# EAGLE schematic Kaya (EAGLE 8.5.0)

## Sheet 1 of 2: Power Supply
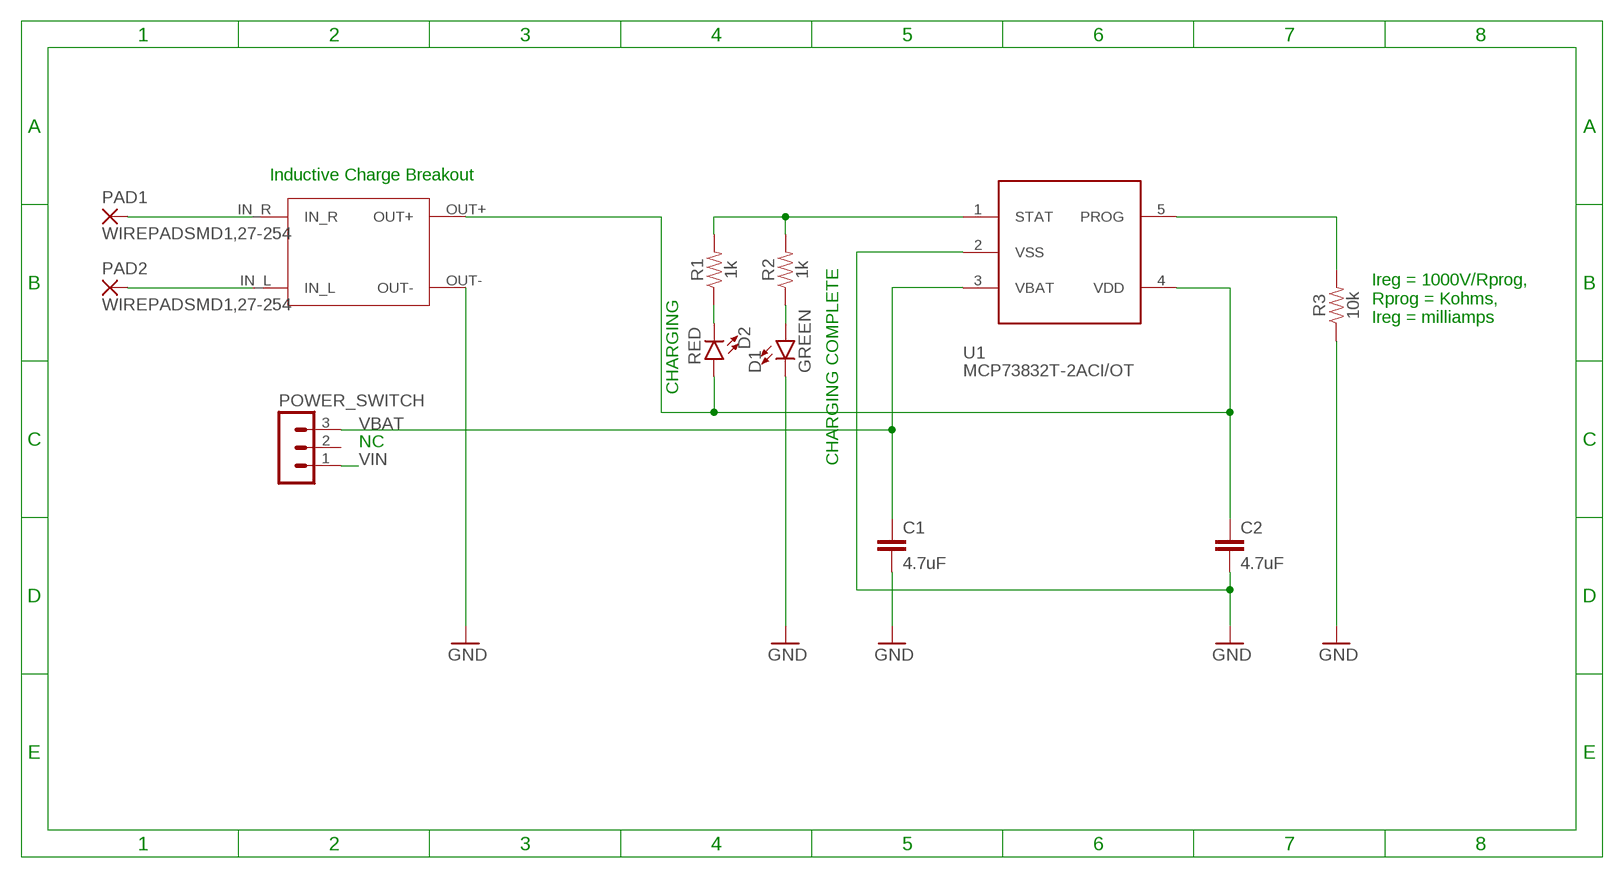
[diagram p0: schematic, sheet 1]

### Parts
C1  4.7uF  4.7UF0603  [0603]
C2  4.7uF  4.7UF0603  [0603]
D1  GREEN  LED-GREEN0603  [LED-0603]
D2  RED  LED-RED0603  [LED-0603]
PAD1  WIREPADSMD1,27-254  [SMD1,27-2,54]
PAD2  WIREPADSMD1,27-254  [SMD1,27-2,54]
POWER_SWITCH  MA03-1  [MA03-1]
R1  1k  1KOHM-0603-1/10W-1%  [0603]
R2  1k  1KOHM-0603-1/10W-1%  [0603]
R3  10k  10KOHM-0603-1/10W-1%  [0603]
U1  MCP73832T-2ACI/OT  [SOT23-5]
U$1  INDUCTIVE-CHARGE-5V  [INDUCTIVE-CHARGE-5V]

### Nets
GND: C1.2 C2.2 D1.C R3.1 U1.2(VSS) U$1.OUT- ; also sheet 2
N$1: R3.2 U1.5(PROG)
N$2: C2.1 D2.A U1.4(VDD) U$1.OUT+
N$7: D2.C R1.1
N$8: R1.2 R2.2 U1.1(STAT)
N$9: D1.A R2.1
N$10: PAD1.1(P) U$1.IN_R
N$11: PAD2.1(P) U$1.IN_L
VBAT: C1.1 POWER_SWITCH.3 U1.3(VBAT)
VIN: POWER_SWITCH.1 ; also sheet 2
Unconnected: POWER_SWITCH.2

### Notes on the sheet
- Inductive Charge Breakout
- Ireg = 1000V/Rprog,
  Rprog = Kohms,
  Ireg = milliamps
- CHARGING
- NC
- CHARGING COMPLETE

## Sheet 2 of 2: BLE NANO + IMU
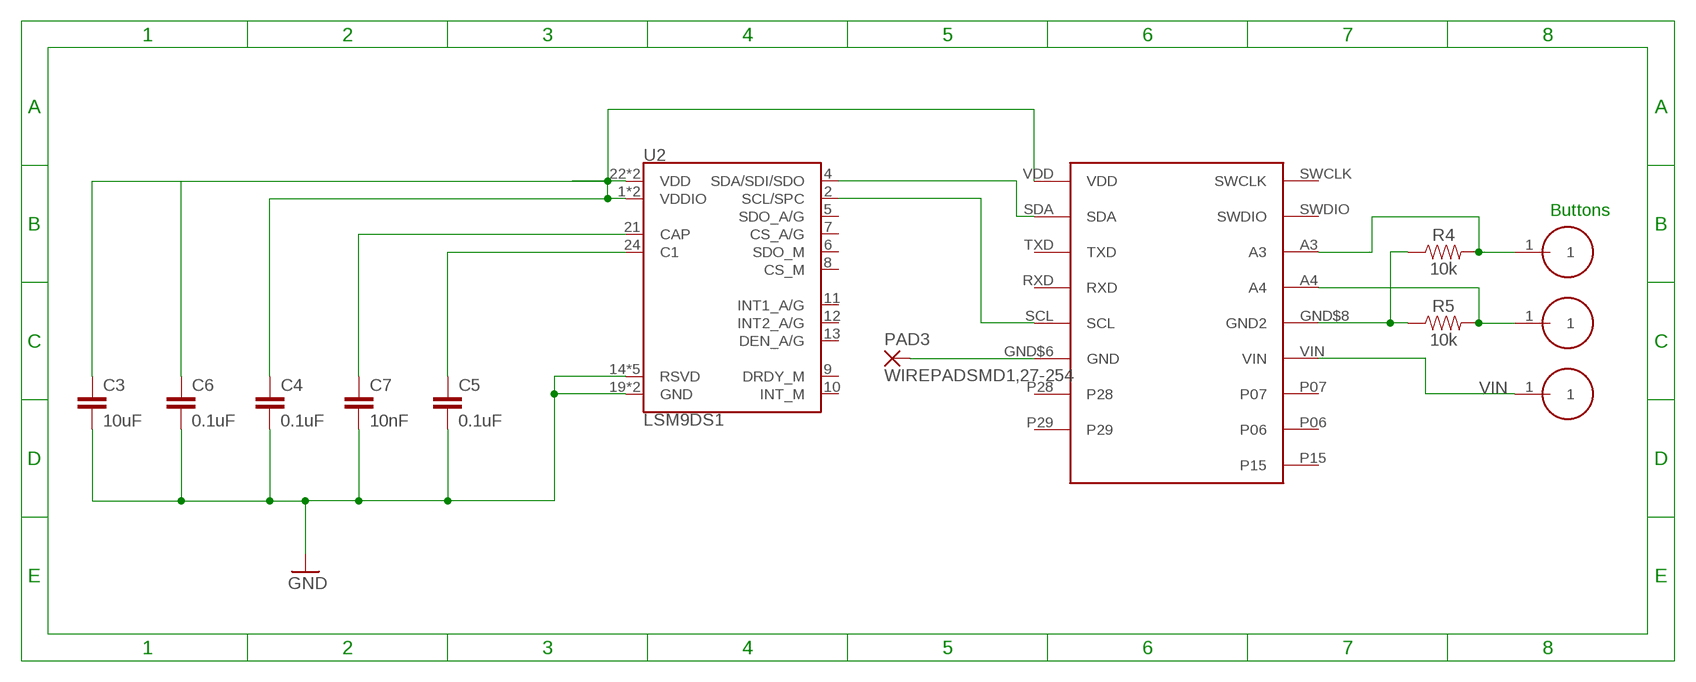
[diagram p1: schematic, sheet 2]

### Parts
C3  10uF  10UF-0603-6.3V-20%  [0603]
C4  0.1uF  0.1UF-0603-25V-(+80/-20%)  [0603]
C5  0.1uF  0.1UF-0603-25V-(+80/-20%)  [0603]
C6  0.1uF  0.1UF-0603-25V-(+80/-20%)  [0603]
C7  10nF  10NF-0603-50V-10%  [0603]
PAD3  WIREPADSMD1,27-254  [SMD1,27-2,54]
R4  10k  10KOHM-0603-1/10W-1%  [0603]
R5  10k  10KOHM-0603-1/10W-1%  [0603]
U2  LSM9DS1  [LGA-24-3.5X3]
U$2  BLE-NANO  [BLE-NANO-PKG]
U$3  CONDUCTIVE-BUTTON  [CONDUCTIVE-BUTTON]
U$4  CONDUCTIVE-BUTTON  [CONDUCTIVE-BUTTON]
U$5  CONDUCTIVE-BUTTON  [CONDUCTIVE-BUTTON]

### Nets
GND: C3.2 C4.2 C5.2 C6.2 C7.2 U2.14(RSVD) U2.15(RSVD) U2.16(RSVD) U2.17(RSVD) U2.18(RSVD) U2.19(GND) U2.20(GND) ; also sheet 1
N$3: R4.1 R5.1 U$2.GND$8(GND2)
N$4: R4.2 U$2.A3 U$3.1
N$5: PAD3.1(P) U$2.GND$6(GND)
N$6: R5.2 U$2.A4 U$4.1
N$12: C5.1 U2.24(C1)
N$14: C7.1 U2.21(CAP)
N$16: U2.4(SDA/SDI/SDO) U$2.SDA
N$17: U2.2(SCL/SPC) U$2.SCL
VDD: C3.1 C4.1 C6.1 U2.1(VDDIO) U2.3(VDDIO) U2.22(VDD) U2.23(VDD) U$2.VDD
VIN: U$2.VIN U$5.1 ; also sheet 1
Unconnected: U2.5(SDO_A/G) U2.6(SDO_M) U2.7(CS_A/G) U2.8(CS_M) U2.9(DRDY_M) U2.10(INT_M) U2.11(INT1_A/G) U2.12(INT2_A/G) U2.13(DEN_A/G) U$2.P06 U$2.P07 U$2.P15 U$2.P28 U$2.P29 U$2.RXD U$2.SWCLK U$2.SWDIO U$2.TXD

### Notes on the sheet
- Buttons

## Library data of the parts
C1 C2 = SparkFun-Capacitors:4.7UF: 4.7µF ceramic capacitors A capacitor is a passive two-terminal electrical component used to store electrical energy temporarily in an electric field.; PROD_ID: CAP-08280
C3 = SparkFun-Capacitors:10UF: 10.0µF ceramic capacitors A capacitor is a passive two-terminal electrical component used to store electrical energy temporarily in an electric field.; PROD_ID: CAP-11015
C4-C6 = SparkFun-Capacitors:0.1UF: 0.1µF ceramic capacitors A capacitor is a passive two-terminal electrical component used to store electrical energy temporarily in an electric field.; PROD_ID: CAP-00810
C7 = SparkFun-Capacitors:10NF: 0.01uF/10nF/10,000pF ceramic capacitors A capacitor is a passive two-terminal electrical component used to store electrical energy temporarily in an electric field. CAP-09321; PROD_ID: CAP-00867
D1 = SparkFun-LED:LED-GREEN: Green SMD LED Used in manufacturing of various products at SparkFun Packages: 0603 - SMD 0603 package [Product Link] <http://www.futureelectronics.com/en/technologies/semiconductors/optoelectronics/leds/Pages/9894312-LTST-C190GKT.aspx?CrossPart=HSMG-C190&IM=0> LilyPad 1206 - SMD1206 LilyPad package [Product Link] <http://www.futureelectronics.com/en/Technologies/Product.aspx?ProductID=IN150NGHARVATEKCORPORATION2049943&IM=0> 1206 - SMD1206 package [Product Link] <http://www.futureelectronics.com/en/technologies/semiconductors/optoelectronics/leds/Pages/8315665-LTST-C150KGKT.aspx?IM=0> 1206 Bottom Mount -SMD 1206 Bottom Mount [Product Link] <http://www.digikey.com/product-detail/en/lite-on-inc/LTST-C230KGKT/160-1456-1-ND/386854> SparkFun Products: Pro Mini 328 -5V <https://www.sparkfun.com/products/821> RedBoard <https://www.sparkfun.com/products/12757> MP3 Trigger <https://www.sparkfun.com/products/13720> Makey Makey <https://www.sparkfun.com/products/11076>; PROD_ID: DIO-00821
D2 = SparkFun-LED:LED-RED: Red SMD LED Used in manufacturing of most products at SparkFun Packages: 0603 - SMD 0603 package [Product Link] <http://docs.avagotech.com/docs/AV02-0551EN> 0603 SMART - SMD 0603 SMART package ( more efficient and expensive)[Product Link] <http://www.osram-os.com/Graphics/XPic2/00077099_0.pdf> 1206 - SMD1206 package [Product Link] <https://www.sparkfun.com/datasheets/DevTools/LilyPad/Q150OVS4.pdff> SparkFun Products: Pro Mini 328 -5V <https://www.sparkfun.com/products/821> RedBoard <https://www.sparkfun.com/products/12757> IOIO-OTG <https://www.sparkfun.com/products/13613>; PROD_ID: DIO-00819
PAD1-PAD3 = wirepad:WIREPAD: Wire PAD connect wire on PCB
POWER_SWITCH = con-lstb:MA03-1: PIN HEADER; OC_FARNELL: unknown; OC_NEWARK: unknown
R1 R2 = SparkFun-Resistors:1KOHM: 1kΩ resistor A resistor is a passive two-terminal electrical component that implements electrical resistance as a circuit element. Resistors act to reduce current flow, and, at the same time, act to lower voltage levels within circuits. - Wikipedia; PROD_ID: RES-07856
R3-R5 = SparkFun-Resistors:10KOHM: 10kΩ resistor A resistor is a passive two-terminal electrical component that implements electrical resistance as a circuit element. Resistors act to reduce current flow, and, at the same time, act to lower voltage levels within circuits. - Wikipedia; PROD_ID: RES-00824
U1 = MCP73832T-2ACI_OT:MCP73832T-2ACI/OT: http://octopart.com/mcp73832t-2aci%2Fot-microchip-664172; AVAILABILITY: Unavailable; MF: Microchip; MP: MCP73832T-2ACI-OT; PACKAGE: SOT-23-5 Microchip; PRICE: None
U2 = SparkFun-Sensors:LSM9DS1: ST Microelectronics LSM9DS1 9DOF IMU - Accelerometer, Gyroscope & Magnetometer The LSM9DS1 is a versatile, motion-sensing system-in-a-chip. It houses a 3-axis accelerometer, 3-axis gyroscope, and 3-axis magnetometer – nine degrees of freedom (9DOF) in a single IC! The LSM9DS1 is equipped with a digital interface, but even that is flexible: it supports both I2C and SPI, so you’ll be hard-pressed to find a microcontroller it doesn’t work with. Datasheet <https://cdn.sparkfun.com/assets/learn_tutorials/3/7/3/LSM9DS1_Datasheet.pdf> SparkFun Products SparkFun 9 Degrees of Freedom IMU Breakout - LSM9DS1 <https://www.sparkfun.com/products/13284> (SEN-13284) SparkFun Photon IMU Shield <https://www.sparkfun.com/products/13629> (DEV-13629); PROD_ID: IC-12536
U$1 = tex-tronics:INDUCTIVE-CHARGE-5V
U$2 = BLE-NANO:BLE-NANO
U$3-U$5 = tex-tronics:CONDUCTIVE-BUTTON